# EAGLE design lora_32_v6 (EAGLE 9.5.2)

## Sheet 1 of 3
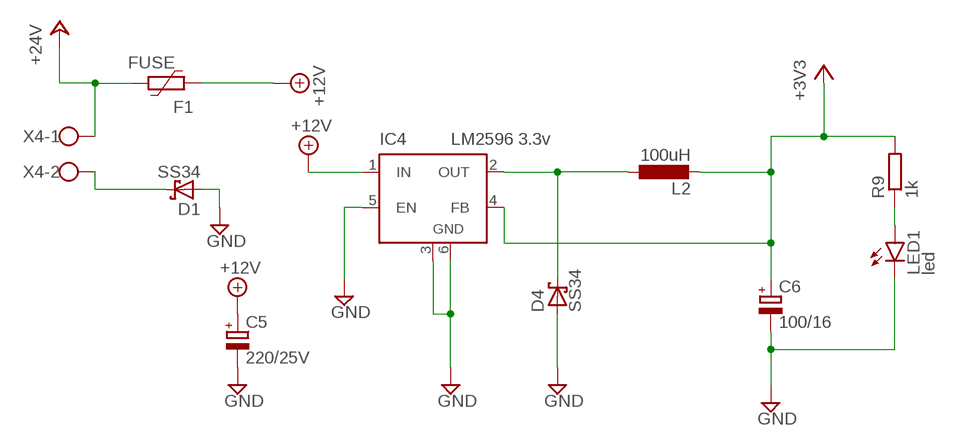
[diagram p0: schematic, sheet 1]

### Parts
C5  220/25V  CPOL-EUG  [PANASONIC_G]
C6  100/16  CPOL-EU140CLH-0810  [140CLH-0810]
D1  SS34  SCHOTTKY-DIODESMD  [SMB]
D4  SS34  SCHOTTKY-DIODESMD  [SMB]
F1  FUSE  1812L010  [1812L]
IC4  LM2596 3.3v  LM2596S  [TO263-5]
L2  100uH  L-EU6000-XXX-RC  [6000-XXXX-RC]
LED1  led  LEDSML0805  [SML0805]
R9  1k  R-EU_M0805  [M0805]
X4  W237-102  [W237-102]

### Nets
+3V3: C6.+ IC4.4(FB) L2.2 R9.2 ; also sheet 2,3
+12V: C5.+ F1.2 IC4.1(IN)
+24V: F1.1 X4.1 ; also sheet 2
GND: C5.- C6.- D1.A D4.A IC4.3(GND) IC4.5(EN) IC4.6(GND) LED1.C ; also sheet 2,3
N$4: D4.C IC4.2(OUT) L2.1
N$15: LED1.A R9.1
N$17: D1.C X4.2

## Sheet 2 of 3
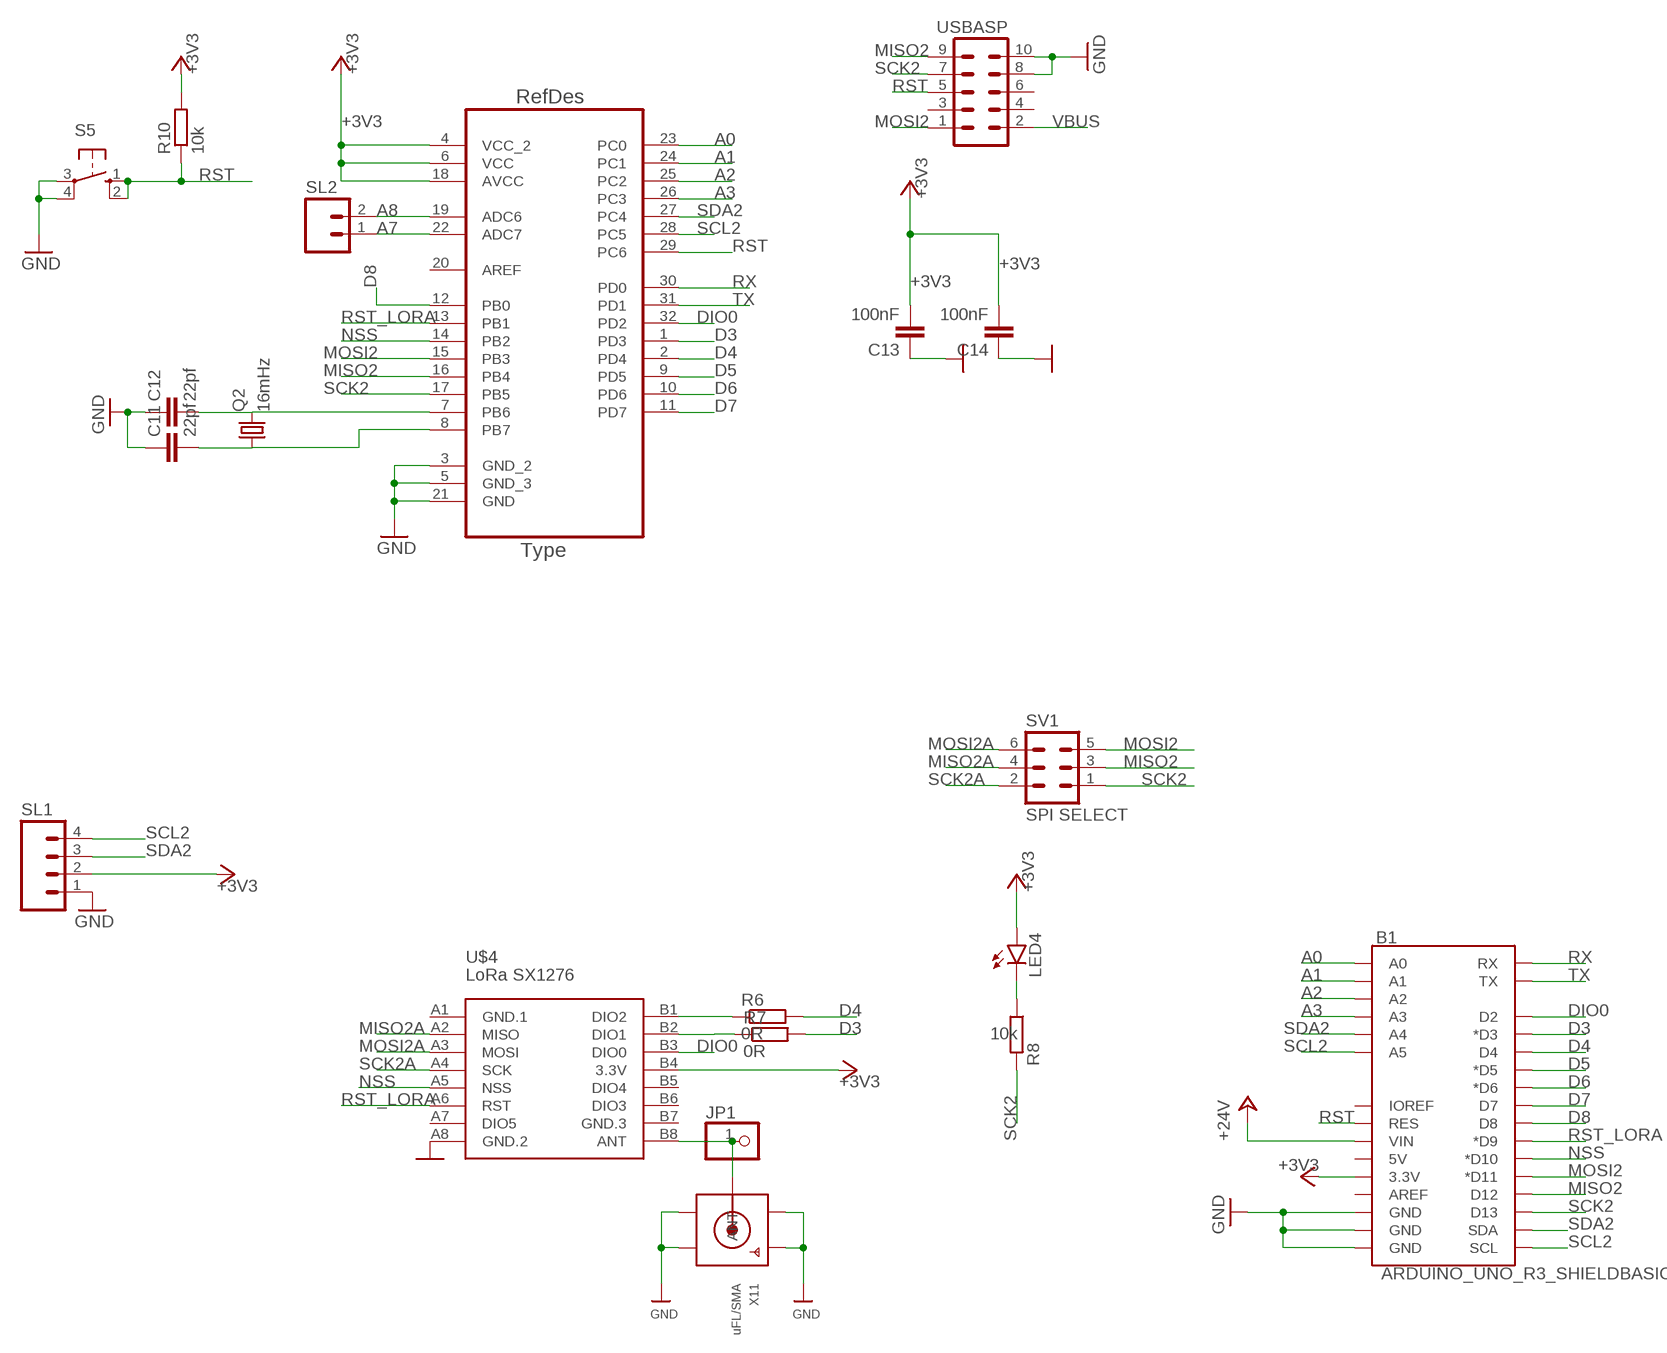
[diagram p1: schematic, sheet 2]

### Parts
B1  ARDUINO_UNO_R3_SHIELDBASIC  [UNO_R3_SHIELD]
C11  22pf  C-EUC0805K  [C0805K]
C12  22pf  C-EUC0805K  [C0805K]
C13  100nF  C-EUC0805K  [C0805K]
C14  100nF  C-EUC0805K  [C0805K]
JP1  HEADER-1X1ROUND  [1X01_ROUND]
LED4  LEDSML0805  [SML0805]
Q2  16mHz  CRYSTALHC49UP  [HC49UP]
R6  0R  R-EU_M0805  [M0805]
R7  0R  R-EU_M0805  [M0805]
R8  10k  R-EU_M0805  [M0805]
R10  10k  R-EU_M0805  [M0805]
S5  10-XX  [B3F-10XX]
SL1  M04  [04P]
SL2  M02  [02P]
SV1  SPI SELECT  MA03-2  [MA03-2]
U1  ATMEGA328P-AU  [QFP80P900X900X120-32N]
U$4  LoRa SX1276  WIRELESS-LORA-RFM95W#SMD  [WIRELESS-LORA-RFM95W#SMD]
USBASP  MA05-2  [MA05-2]
X11  uFL/SMA  SMACONNECTOR_EDGE_UFL  [SMA_EDGELAUNCH_UFL]

### Nets
+3V3: B1.3.3V C13.2 C14.2 LED4.A R10.2 SL1.2 U1.4(VCC_2) U1.6(VCC) U1.18(AVCC) U$4.B4(3.3V) ; also sheet 1,3
+24V: B1.VIN ; also sheet 1
A0: B1.A0 U1.23(PC0)
A1: B1.A1 U1.24(PC1)
A2: B1.A2 U1.25(PC2)
A3: B1.A3 U1.26(PC3)
A7: SL2.1 U1.22(ADC7)
A8: SL2.2 U1.19(ADC6)
D3: B1.D3(*D3) R7.2 U1.1(PD3)
D4: B1.D4 R6.2 U1.2(PD4)
D5: B1.D5(*D5) U1.9(PD5)
D6: B1.D6(*D6) U1.10(PD6)
D7: B1.D7 U1.11(PD7)
D8: B1.D8 U1.12(PB0)
DIO0: B1.D2 U1.32(PD2) U$4.B3(DIO0)
GND: B1.GND@0(GND) B1.GND@1(GND) B1.GND@2(GND) C11.1 C12.1 C13.1 C14.1 S5.3(P) S5.4(P1) SL1.1 U1.3(GND_2) U1.5(GND_3) U1.21(GND) U$4.A8(GND.2) USBASP.8 USBASP.10 X11.GND@1(GND1) X11.GND@2(GND2) X11.GND@3(GND3) X11.GND@4(GND4) ; also sheet 1,3
MISO2: B1.D12 SV1.3 U1.16(PB4) USBASP.9
MISO2A: SV1.4 U$4.A2(MISO)
MOSI2: B1.D11(*D11) SV1.5 U1.15(PB3) USBASP.1
MOSI2A: SV1.6 U$4.A3(MOSI)
N$3: C12.2 Q2.2 U1.7(PB6)
N$5: C11.2 Q2.1 U1.8(PB7)
N$20: R7.1 U$4.B2(DIO1)
N$21: R6.1 U$4.B1(DIO2)
N$22: LED4.C R8.1
N$37: JP1.1 U$4.B8(ANT) X11.P(ANT)
NSS: B1.D10(*D10) U1.14(PB2) U$4.A5(NSS)
RST: B1.RES R10.1 S5.1(S) S5.2(S1) U1.29(PC6) USBASP.5 ; also sheet 3
RST_LORA: B1.D9(*D9) U1.13(PB1) U$4.A6(RST)
RX: B1.RX U1.30(PD0) ; also sheet 3
SCK2: B1.D13 R8.2 SV1.1 U1.17(PB5) USBASP.7
SCK2A: SV1.2 U$4.A4(SCK)
SCL2: B1.A5 B1.SCL SL1.4 U1.28(PC5)
SDA2: B1.A4 B1.SDA SL1.3 U1.27(PC4)
TX: B1.TX U1.31(PD1) ; also sheet 3
VBUS: USBASP.2 ; also sheet 3
Unconnected: B1.5V B1.AREF B1.IOREF U1.20(AREF) U$4.A7(DIO5) U$4.B5(DIO4) U$4.B6(DIO3) USBASP.3 USBASP.4 USBASP.6

## Sheet 3 of 3
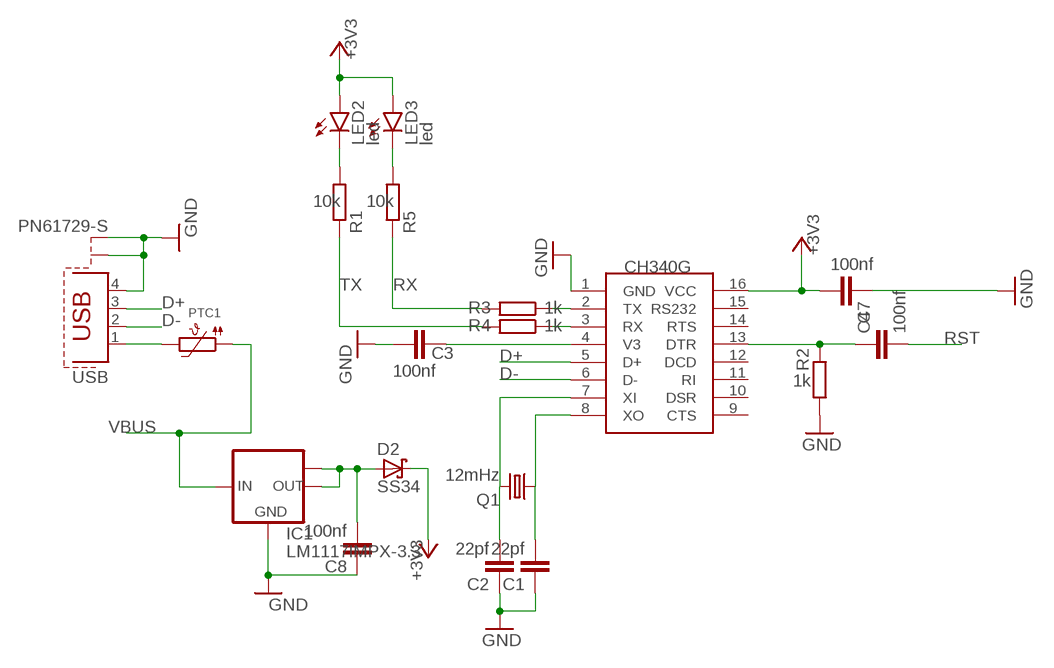
[diagram p2: schematic, sheet 3]

### Parts
C1  22pf  C-EUC0805K  [C0805K]
C2  22pf  C-EUC0805K  [C0805K]
C3  100nf  C-EUC0805K  [C0805K]
C4  100nf  C-EUC0805K  [C0805K]
C7  100nf  C-EUC0805K  [C0805K]
C8  100nf  C-EUC0805K  [C0805K]
D2  SS34  SCHOTTKY-DIODESMD  [SMB]
IC1  LM1117IMPX-3.3  [SOT223]
LED2  led  LEDSML0805  [SML0805]
LED3  led  LEDSML0805  [SML0805]
PTC1  PTC1206  [1206]
Q1  12mHz  CRYSTALHC49UP  [HC49UP]
R1  10k  R-EU_M0805  [M0805]
R2  1k  R-EU_M0805  [M0805]
R3  1k  R-EU_M0805  [M0805]
R4  1k  R-EU_M0805  [M0805]
R5  10k  R-EU_M0805  [M0805]
U$5  CH340G  [SOIC16]
USB  PN61729-S  [PN61729-S]

### Nets
+3V3: C7.2 D2.C LED2.A LED3.A U$5.16(VCC) ; also sheet 1,2
D+: U$5.5(D+) USB.3
D-: U$5.6(D-) USB.2
GND: C1.1 C2.1 C3.1 C7.1 C8.1 IC1.1(GND) R2.1 U$5.1(GND) USB.4 USB.S1 USB.S2 ; also sheet 1,2
N$7: C2.2 Q1.2 U$5.7(XI)
N$8: C1.2 Q1.1 U$5.8(XO)
N$9: C3.2 U$5.4(V3)
N$10: C4.1 R2.2 U$5.13(DTR)
N$11: R3.1 U$5.2(TX)
N$12: R4.1 U$5.3(RX)
N$13: PTC1.2 USB.1
N$14: C8.2 D2.A IC1.2(OUT) IC1.TAB(OUT1)
N$18: LED3.C R5.1
N$19: LED2.C R1.1
RST: C4.2 ; also sheet 2
RX: R3.2 R5.2 ; also sheet 2
TX: R1.2 R4.2 ; also sheet 2
VBUS: IC1.3(IN) PTC1.1 ; also sheet 2
Unconnected: U$5.9(CTS) U$5.10(DSR) U$5.11(RI) U$5.12(DCD) U$5.14(RTS) U$5.15(RS232)

## Power pins joined to a net without a drawn wire
GND.1: U$4.A1(GND.1)
GND.3: U$4.B7(GND.3)

## Library data of the parts
B1 = SparkFun-Boards:ARDUINO_UNO_R3_SHIELD: Arduino R3 Shield Footprint Shield form compatible with the Arduino Uno R3. SparkFun Products: MG2639 Cellular Shield <https://www.sparkfun.com/products/13120> MIDI Shield <https://www.sparkfun.com/products/12898> R3 Stackable Headers Kit <https://www.sparkfun.com/products/11417>
C1-C4 C7 C8 C11-C14 = rcl:C-EU: CAPACITOR, European symbol; SPICEPREFIX: C
C5 C6 = rcl:CPOL-EU: POLARIZED CAPACITOR, European symbol; SPICEPREFIX: C
D1 D2 D4 = diode:SCHOTTKY-DIODE: Schottky Diode
F1 = polyfuse-smd_10:?: Polyfuse Resettable PTC Source: http://www.littelfuse.com/products/resettable-ptcs.aspx; MF: Littelfuse; MPN: 1812L010; OC_FARNELL: 1822210; OC_NEWARK: 78R5551
IC1 = lm1117:LM1117IMPX-*
IC4 = linear:LM2596S: STEP-DOWN VOLTAGE REGULATOR
JP1 = microbuilder:HEADER-1X1: PIN HEADER
L2 = rcl:L-EU: INDUCTOR, European symbol; SPICEPREFIX: L
LED1-LED4 = led:LED: LED OSRAM: - CHIPLED LG R971, LG N971, LY N971, LG Q971, LY Q971, LO R971, LY R971 LH N974, LH R974 LS Q976, LO Q976, LY Q976 LO Q996 - Hyper CHIPLED LW Q18S LB Q993, LB Q99A, LB R99A - SideLED LS A670, LO A670, LY A670, LG A670, LP A670 LB A673, LV A673, LT A673, LW A673 LH A674 LY A675 LS A676, LA A676, LO A676, LY A676, LW A676 LS A679, LY A679, LG A679 - Hyper Micro SIDELED® LS Y876, LA Y876, LO Y876, LY Y876 LT Y87S - SmartLED LW L88C, LW L88S LB L89C, LB L89S, LG L890 LS L89K, LO L89K, LY L89K LS L896, LA L896, LO L896, LY L896 - TOPLED LS T670, LO T670, LY T670, LG T670, LP T670 LSG T670, LSP T670, LSY T670, LOP T670, LYG T670 LG T671, LOG T671, LSG T671 LB T673, LV T673, LT T673, LW T673 LH T674 LS T676, LA T676, LO T676, LY T676, LB T676, LH T676, LSB T676, LW T676 LB T67C, LV T67C, LT T67C, LS T67K, LO T67K, LY T67K, LW E67C LS E67B, LA E67B, LO E67B, LY E67B, LB E67C, LV E67C, LT E67C LW T67C LS T679, LY T679, LG T679 LS T770, LO T770, LY T770, LG T770, LP T770 LB T773, LV T773, LT T773, LW T773 LH T774 LS E675, LA E675, LY E675, LS T675 LS T776, LA T776, LO T776, LY T776, LB T776 LHGB T686 LT T68C, LB T68C - Hyper Mini TOPLED® LB M676 - Mini TOPLED Santana® LG M470 LS M47K, LO M47K, LY M47K Source: http://www.osram.convergy.de LUXEON: - LUMILED® LXK2-PW12-R00, LXK2-PW12-S00, LXK2-PW14-U00, LXK2-PW14-V00 LXK2-PM12-R00, LXK2-PM12-S00, LXK2-PM14-U00 LXK2-PE12-Q00, LXK2-PE12-R00, LXK2-PE12-S00, LXK2-PE14-T00, LXK2-PE14-U00 LXK2-PB12-K00, LXK2-PB12-L00, LXK2-PB12-M00, LXK2-PB14-N00, LXK2-PB14-P00, LXK2-PB14-Q00 LXK2-PR12-L00, LXK2-PR12-M00, LXK2-PR14-Q00, LXK2-PR14-R00 LXK2-PD12-Q00, LXK2-PD12-R00, LXK2-PD12-S00 LXK2-PH12-R00, LXK2-PH12-S00 LXK2-PL12-P00, LXK2-PL12-Q00, LXK2-PL12-R00 Source: www.luxeon.com KINGBRIGHT: KA-3528ASYC Source: www.kingbright.com
PTC1 = microbuilder:PTC: PTC (Resettable Fuse) 1206 Package 250mA PTC (16V Max, Time-to-Trip: 0.08s) - Digikey: F2110CT-ND 1210 Package 100mA PTC (30V Max, Time-to-Trip: 0.6s) - Digikey: MF-USMF010-2CT-ND 1812 Package 750mA PTC (24V Max, Time-to-Trip: 0.2s) - Digikey: MF-MSMF075/24-2CT-ND
Q1 Q2 = crystal:CRYSTAL: CRYSTAL; OC_FARNELL: unknown; OC_NEWARK: unknown
R1-R10 = rcl:R-EU_: RESISTOR, European symbol; SPICEPREFIX: R
S5 = switch-omron:10-XX: OMRON SWITCH; MPN: B3F-1000; OC_FARNELL: 176432; OC_NEWARK: 36M3542
SL1 = con-amp-quick:M04: AMP QUICK CONNECTOR; OC_FARNELL: unknown; OC_NEWARK: unknown
SL2 = con-amp-quick:M02: AMP QUICK CONNECTOR; OC_FARNELL: unknown; OC_NEWARK: unknown
SV1 = con-lstb:MA03-2: PIN HEADER; OC_FARNELL: unknown; OC_NEWARK: unknown
U1 = Atmel-ATMEGA328P-AU:ATMEGA328P-AU; DESCRIPTION: 8-bit Microcontroller with In-System Programmable Flash; MPN: ATMEGA328P-AU; OC_FARNELL: 1715486; OC_NEWARK: 14R4631; PACKAGE: TQFP-32; SUPPLIER: Atmel
U$4 = diy-modules:WIRELESS-LORA-RFM95W: 868/915 MHz LoRa Radio Transceiver Module based on SX1276 chip Click here to find device on ebay.com <http://www.ebay.com/sch/RFM95W+transceiver>
U$5 = ch340g:CH340G
USB = con-berg:PN61729-S: BERG USB connector; OC_FARNELL: unknown; OC_NEWARK: unknown
USBASP = con-lstb:MA05-2: PIN HEADER; OC_FARNELL: unknown; OC_NEWARK: unknown
X4 = con-wago-500-edit:W237-102: WAGO SCREW CLAMP; MPN: 237-102; OC_FARNELL: unknown; OC_NEWARK: 70K9898
X11 = microbuilder:SMACONNECTOR: SMA Connector 90° DIP SMA Connector, 50 Ohm (4UConnector: 07259)

## Net classes
0 default: width 0.152 mm, drill 0.152 mm, clearance 0.381 mm

## Board
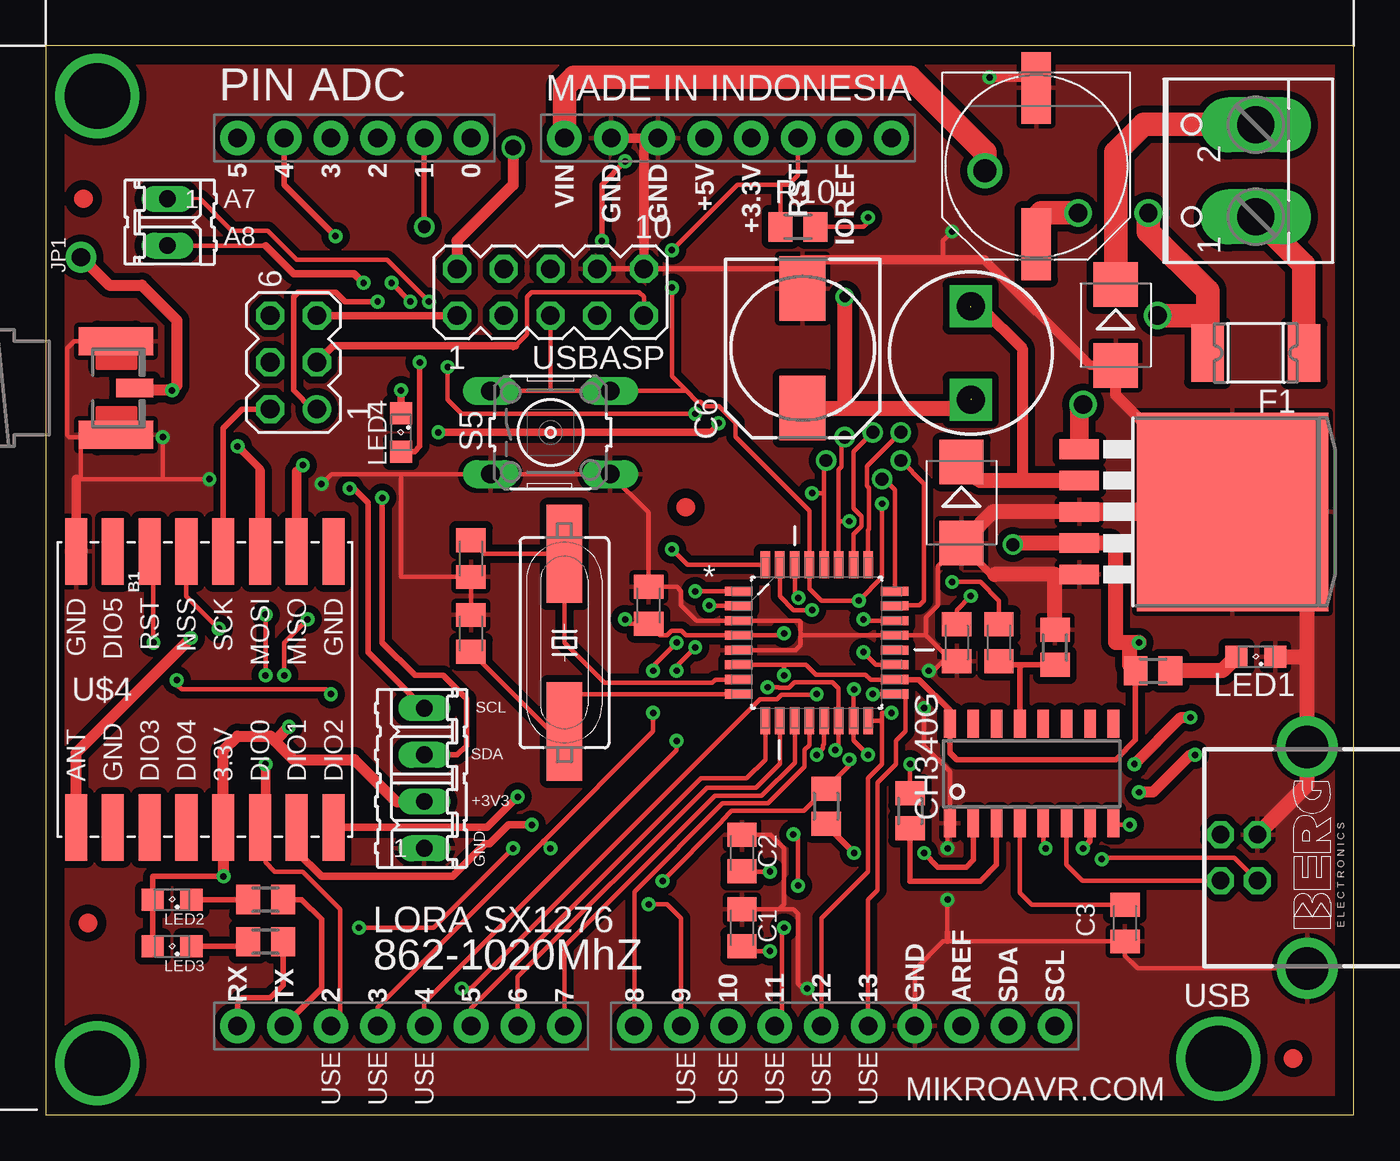
[diagram p3: board, top side]
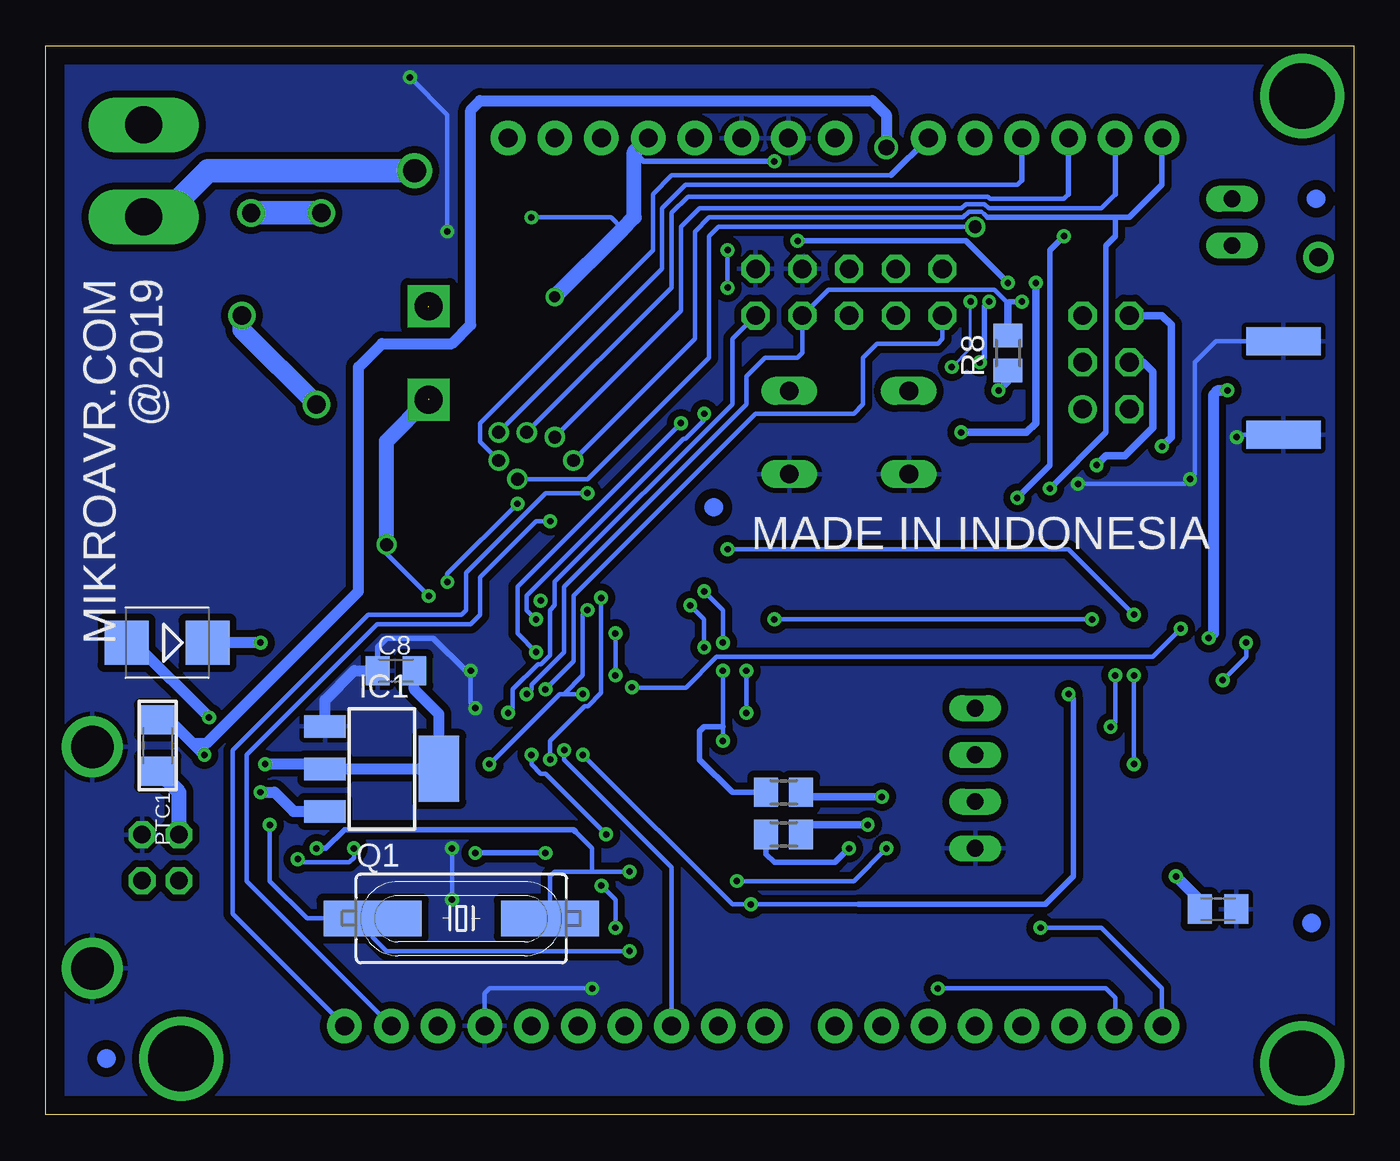
[diagram p4: board, bottom side, seen from below]

Size 71.1 x 58.09 mm. Coordinates in mm from the lower left corner, seen from the top.
Outline: 0,0 71.1,0 71.1,58.09 0,58.09 0,0
Copper layers (1*16): Top 0.035mm / dielectric 1.5mm / Bottom 0.035mm
Design rules "default": minimum track width 6mil, minimum drill 0.35mm, track to track 6mil, track to pad 6mil, pad to pad 6mil, via to via 6mil, smd to smd 6mil, copper to edge 40mil, drill to drill 6mil, minimum pad ring 10mil, minimum via ring 8mil, stop-mask expansion 4mil, vias tented up to drill 0mil, thermal gap 10mil

### Footprints (pad centres in the part's own frame; a part is rotated, then mirrored left to right if it is on the bottom)
UNO_R3_SHIELD = drill 1.016 pad 1.88: 3.3V 24.13,-2.54; 5V 24.13,0; A0 24.13,12.7; A1 24.13,15.24; A2 24.13,17.78; A3 24.13,20.32; A4 24.13,22.86; A5 24.13,25.4; AREF -24.13,-13.97; D2 -24.13,20.32; D3 -24.13,17.78; D4 -24.13,15.24; D5 -24.13,12.7; D6 -24.13,10.16; D7 -24.13,7.62; D8 -24.13,3.81; D9 -24.13,1.27; D10 -24.13,-1.27; D11 -24.13,-3.81; D12 -24.13,-6.35; D13 -24.13,-8.89; GND@0 24.13,2.54; GND@1 24.13,5.08; GND@2 -24.13,-11.43; IOREF 24.13,-7.62; NC 24.13,-10.16; RES 24.13,-5.08; RX -24.13,25.4; SCL -24.13,-19.05; SDA -24.13,-16.51; TX -24.13,22.86; VIN 24.13,7.62
C0805K = smd 1.3 x 1.6: 1 -1,0; 2 1,0
PANASONIC_G = smd 3.9 x 1.6: + 4.25,0; - -4.25,0
140CLH-0810 = smd 3.5 x 2.5: + 3.25,0; - -3.25,0
SMB = smd 2.4 x 2.4: A 2.2,0; C -2.2,0
1812L = smd 1.78 x 3.15: 1 -2.62,0; 2 2.62,0
SOT223 = smd 1.219 x 2.235: 1 -2.311,-3.099; 2 0,-3.099; 3 2.311,-3.099 | smd 3.6 x 2.2: TAB 0,3.099
TO263-5 = smd 1.067 x 2.159: 1 -3.404,-5.791; 2 -1.702,-5.791; 3 0,-5.791; 4 1.702,-5.791; 5 3.404,-5.791 | smd 10.8 x 10.41: 6 0,2.54
1X01_ROUND = drill 1 pad 1.676: 1 0,0
6000-XXXX-RC = drill 0.9 pad 1.422: 1 -2.5,0; 2 2.5,0
SML0805 = smd 1.2 x 1.2: A 1.05,0; C -1.05,0
1206 = smd 1.6 x 1.8: 1 -1.4,0; 2 1.4,0
HC49UP = smd 5.334 x 1.93: 1 -4.826,0; 2 4.826,0
M0805 = smd 1.3 x 1.6: 1 -0.95,0; 2 0.95,0
B3F-10XX = drill 1.016 long: 1 -3.251,2.261; 2 3.251,2.261; 3 -3.251,-2.261; 4 3.251,-2.261
04P = drill 0.914 long: 1 -3.81,0; 2 -1.27,0; 3 1.27,0; 4 3.81,0
02P = drill 0.914 long: 1 -1.27,0; 2 1.27,0
MA03-2 = drill 1.016: 1 -2.54,-1.27 | drill 1.016 octagon: 2 -2.54,1.27; 3 0,-1.27; 4 0,1.27; 5 2.54,-1.27; 6 2.54,1.27
QFP80P900X900X120-32N = smd 1.473 x 0.508: 1 -4.242,2.794; 2 -4.242,2.007; 3 -4.242,1.194; 4 -4.242,0.406; 5 -4.242,-0.406; 6 -4.242,-1.194; 7 -4.242,-2.007; 8 -4.242,-2.794; 17 4.242,-2.794; 18 4.242,-2.007; 19 4.242,-1.194; 20 4.242,-0.406; 21 4.242,0.406; 22 4.242,1.194; 23 4.242,2.007; 24 4.242,2.794 | smd 0.508 x 1.473: 9 -2.794,-4.242; 10 -2.007,-4.242; 11 -1.194,-4.242; 12 -0.406,-4.242; 13 0.406,-4.242; 14 1.194,-4.242; 15 2.007,-4.242; 16 2.794,-4.242; 25 2.794,4.242; 26 2.007,4.242; 27 1.194,4.242; 28 0.406,4.242; 29 -0.406,4.242; 30 -1.194,4.242; 31 -2.007,4.242; 32 -2.794,4.242
WIRELESS-LORA-RFM95W#SMD = smd 3.6 x 1.2: A1 -7.5,7; A2 -7.5,5; A3 -7.5,3; A4 -7.5,1; A5 -7.5,-1; A6 -7.5,-3; A7 -7.5,-5; A8 -7.5,-7; B1 7.5,7; B2 7.5,5; B3 7.5,3; B4 7.5,1; B5 7.5,-1; B6 7.5,-3; B7 7.5,-5; B8 7.5,-7
SOIC16 = smd 0.635 x 1.524: 1 -4.445,-2.695; 2 -3.175,-2.695; 3 -1.905,-2.695; 4 -0.635,-2.695; 5 0.635,-2.695; 6 1.905,-2.695; 7 3.175,-2.695; 8 4.445,-2.695; 9 4.445,2.695; 10 3.175,2.695; 11 1.905,2.695; 12 0.635,2.695; 13 -0.635,2.695; 14 -1.905,2.695; 15 -3.175,2.695; 16 -4.445,2.695
PN61729-S = drill 0.95 octagon: 1 1.25,4.71; 2 -1.25,4.71; 3 -1.25,2.71; 4 1.25,2.71 | drill 2.3 pad 2.9: S1 -6.02,0; S2 6.02,0
MA05-2 = drill 1.016 octagon: 1 -5.08,-1.27; 2 -5.08,1.27; 3 -2.54,-1.27; 4 -2.54,1.27; 5 0,-1.27; 6 0,1.27; 7 2.54,-1.27; 8 2.54,1.27; 9 5.08,-1.27; 10 5.08,1.27
W237-102 = drill 2 long: 1 -2.5,-1.27; 2 2.5,-1.27
SMA_EDGELAUNCH_UFL = smd 4.064 x 1.524: GND@1 2.032,-2.54; GND@2 2.032,2.54 | smd 4.064 x 1.524 bottom: GND@3 2.032,2.54; GND@4 2.032,-2.54 | smd 2.032 x 1.016: P 3.048,0

### Placement (x,y rotation side)
B1  35.81,28.96 90 top
C1  37.85,10.16 270 top
C2  37.85,14.22 270 top
C3  58.67,10.41 90 top
C4  51.82,25.65 90 top
C5  53.85,51.56 270 top
C6  41.15,41.66 270 top
C7  7.37,11.18 180 bottom
C8  52.07,24.13 0 bottom
C11  23.11,26.16 270 top
C12  23.11,30.23 90 top
C13  32.77,27.69 270 top
C14  49.53,25.65 90 top
D1  58.17,42.93 270 top
D2  64.52,25.65 180 bottom
D4  49.78,33.27 270 top
F1  65.79,41.4 180 top
IC1  52.83,18.8 270 bottom
IC4  61.98,32.77 270 top
JP1  1.9,46.61 0 top
L2  50.29,41.4 270 top
LED1  65.79,24.89 180 top
LED2  6.86,11.68 180 top
LED3  6.86,9.14 180 top
LED4  19.3,37.08 270 top
PTC1  65.02,20.07 270 bottom
Q1  48.51,10.67 0 bottom
Q2  28.19,25.65 90 top
R1  11.94,11.68 0 top
R2  54.86,25.4 270 top
R3  42.42,16.76 90 top
R4  46.99,16.51 90 top
R5  11.94,9.4 0 top
R6  30.99,17.53 180 bottom
R7  30.99,15.24 180 bottom
R8  18.8,41.4 90 bottom
R9  60.2,24.13 180 top
R10  40.89,48.26 0 top
S5  27.43,37.08 0 top
SL1  20.57,18.29 90 top
SL2  6.6,48.51 270 top
SV1  13.46,40.89 90 top
U1  41.91,25.65 0 top
U$3  [CIRCLE-1MM-2R]  2.03,49.78 0 top
U$4  8.64,23.11 270 top
U$5  53.59,18.54 0 top
U$6  [CIRCLE-1MM-2R]  2.29,10.41 0 top
U$7  [CIRCLE-1MM-2R]  34.8,33.02 0 top
U$8  [CIRCLE-1MM-2R]  67.82,3.05 0 top
USB  68.58,13.97 90 top
USBASP  27.43,44.7 0 top
X4  64.52,51.31 90 top
X11  1.78,39.5 0 top

### Tracks (layer width: path | path; a pad name or v marks a point on that pad's centre or on a via)
+3V3  (via drill 0.35, 0.6, 0.7, 1.52)  (1 unrouted)
  Top 0.254: U1.6 40.13,24.46 | 40.13,24.46 41.33,24.46 41.86,23.92 44.57,23.92 44.85,23.65 U1.18 | v40.13,26.16 40.03,26.06 U1.4 34.81,26.06 34.56,26.31 34.02,26.31 33.77,26.06 33.39,26.06 C13.2 31.73,26.69 v31.5,26.92 | v40.13,23.88 40.13,24.46 | v14.22,26.92 12.95,25.65 v12.95,23.88 | 9.91,15.88 U$4.B4 | C14.2 49.53,27.43 v50.29,28.19 | R10.2 44.45,48.26 44.7,48.51 v44.7,48.77
  Top 0.305: U1.18 47.47,23.65 49.15,21.97 U$5.16 49.15,19.68 49.53,19.3 58.17,19.3 59.25,20.39 R9.2 | LED3.A LED2.A 5.81,12.92 5.84,12.95 v9.65,12.95 | LED4.A 20.03,36.03 20.32,36.32 v20.32,40.89 | v19.81,44.2 v18.8,45.21 | v30.23,47.5 30.23,50.55 v31.5,51.82
  Top 0.61: SL1.2 19.05,17.02 16.76,19.3 13.46,19.3 12.57,20.19 | 12.57,20.19 12.19,20.57 10.41,20.57 9.64,19.8 U$4.B4 9.65,15.6 v9.65,12.95 | v13.21,21.08 12.57,20.45 12.57,20.19
  Top 0.813: C6.+ 43.43,38.41 | 43.43,38.41 49.8,38.41 L2.2 | v52.58,30.99 52.65,31.06 IC4.4 57.84,31.06 58.17,30.73 58.17,25.65 58.93,25.65 | 43.43,38.41 v43.43,44.45 | v59.44,25.65 58.93,25.65 | R9.2 58.93,24.45 58.93,25.65
  Bottom 0.254: v40.13,26.16 v40.13,23.88 | v31.5,26.92 v14.22,26.92 | v12.95,23.88 12.95,21.34 v13.21,21.08 | v50.29,28.19 52.58,30.48 v52.58,30.99 | 8.64,11.94 8.37,11.67 C7.2 | v44.7,48.77 40.39,48.77 39.75,48.13
  Bottom 0.305: v20.32,40.89 20.07,41.15 20.07,43.94 v19.81,44.2 | v18.8,45.21 21.08,47.5 v30.23,47.5 | 39.12,52.32 38.61,51.82 v31.5,51.82
  Bottom 0.61: 8.38,11.68 8.64,11.94 v9.65,12.95 | v59.44,25.65 D2.C
  Bottom 0.813: v52.58,30.99 52.58,36.62 L2.2 | v43.43,44.45 39.75,48.13 39.12,48.77 39.12,52.32 B1.3.3V
  other vias: 50.29,38.86
+12V  (via drill 1)
  Top 1.016: IC4.1 56.19,38.4 v56.39,38.61
  Top 1.27: v59.94,49.02 59.94,48.01 63.17,44.78 63.17,43.43 | v56.13,49.02 54.14,49.02 53.85,48.73 C5.+ | F1.2 63.17,43.43 | v60.45,43.43 63.17,43.43
  Bottom 1.016: v56.39,38.61 60.45,42.67 v60.45,43.43
  Bottom 1.27: v59.94,49.02 v56.13,49.02
+24V  (via drill 1.27)
  Top 1.27: B1.VIN 28.19,55.88 28.7,56.39 46.99,56.39 51.05,52.32 v51.05,51.31 | F1.1 68.41,46.19 X4.1
  Bottom 1.27: v51.05,51.31 62.27,51.31 64.77,48.81 X4.1
A0  (via drill 0.7)
  Top 0.254: U1.23 46.18,27.69 47.5,27.69 47.75,27.94 47.75,34.29 v46.48,35.56
  Bottom 0.254: v46.48,35.56 47.5,36.58 47.5,37.59 38.1,46.99 38.1,50.04 37.08,51.05 25.15,51.05
  Bottom 0.305: 25.15,51.05 B1.A0
A1  (via drill 0.7)
  Top 0.254: U1.24 46.15,33.96 45.57,34.54 v45.47,34.54
  Top 0.305: v20.57,48.26 B1.A1
  Bottom 0.254: v45.47,34.54 41.66,34.54 35.05,41.15 35.05,47.75 34.54,48.26 v20.57,48.26
A2  (via drill 0.7)
  Top 0.254: v46.48,37.08 44.63,35.23 44.63,34.2 44.75,34.08 44.75,31.82 44.7,31.77 U1.25
  Bottom 0.254: v46.48,37.08 37.59,45.97 37.59,49.28 36.32,50.55 18.29,50.55 18.03,50.8
  Bottom 0.305: 18.03,50.8 B1.A2
A3  (via drill 0.7)
  Top 0.254: v44.96,37.08 43.92,36.04 43.92,32.96 44.35,32.53 44.35,31.99 43.92,31.56 U1.26
  Bottom 0.254: v44.96,37.08 37.08,44.96 37.08,49.02 36.2,49.9 19.89,49.9 19.77,49.78 15.75,49.78 15.49,50.04
  Bottom 0.305: 15.49,50.04 B1.A3
A7  (via drill 0.35)
  Top 0.152: 8.38,49.78 SL2.1
  Top 0.254: U1.22 44.53,26.85 v44.45,26.92 | v35.31,38.1 22.61,38.1 21.84,38.86 v21.84,40.64 | v20.83,44.2 18.54,46.48 13.64,46.48 12.06,48.06 10.11,48.06 8.38,49.78
  Bottom 0.152: v21.84,40.64 20.83,41.66 v20.83,44.2 | 36.42,36.73 36.32,36.73 | 35.31,37.75 v35.31,38.1
  Bottom 0.254: v44.45,26.92 44.96,27.43 44.96,28.19 36.42,36.73 | 36.32,36.73 35.31,37.75
A8  (via drill 0.35)
  Top 0.254: U1.19 45.14,24.46 v44.45,25.15 | v36.58,37.59 36.07,37.08 | 11.94,47.24 SL2.2
  Top 0.406: v17.27,45.21 16.76,45.72 13.46,45.72 11.94,47.24 | 36.07,37.08 v21.34,37.08
  Bottom 0.254: v44.45,25.15 45.47,26.16 45.47,28.7 v36.58,37.59
  Bottom 0.406: v17.27,45.21 17.27,37.59 17.78,37.08 v21.34,37.08
D3  (via drill 0.35)
  Top 0.254: B1.D3 18.03,5.84 27.05,14.86 33.02,20.83 v33.02,21.84 | v33.02,24.13 33.02,24.38 v34.29,25.65 | v35.31,28.45 U1.1
  Top 0.305: v27.43,14.48 27.05,14.86
  Bottom 0.254: v33.02,21.84 v33.02,24.13 | v34.29,25.65 34.29,27.43 v35.31,28.45
  Bottom 0.305: R7.2 31.94,14.16 31.5,13.72 28.19,13.72 v27.43,14.48
D4  (via drill 0.35)
  Top 0.254: B1.D4 20.57,6.1 34.29,19.81 v34.29,20.32 | U1.2 36.09,27.66 v36.07,27.69 | v35.31,25.4 34.29,24.38 v34.29,24.13
  Bottom 0.254: v36.07,27.69 35.31,26.92 v35.31,25.4 | v34.29,24.13 34.29,21.08 v34.29,20.32
  Bottom 0.305: R6.2 33.78,17.53 35.56,19.3 35.56,20.83 35.31,21.08 34.29,21.08
D5
  Top 0.254: U1.9 39.12,19.3 38.1,18.29 35.63,18.29 23.11,5.78 B1.D5
D6
  Top 0.254: U1.10 39.9,19.07 38.61,17.78 35.95,17.78 25.65,7.49 B1.D6
D7
  Top 0.254: U1.11 40.72,19.13 38.91,17.32 36.37,17.32 28.19,9.14 B1.D7
D8
  Top 0.254: B1.D8 32,12.12 36.8,16.92 39.27,16.92 41.25,18.9 41.25,19.83 41.5,20.08 U1.12
D+  (via drill 0.35)
  Top 0.254: USB.3 64.62,13.97 57.49,13.97 v57.4,13.89 | v54.36,14.48 54.23,14.61 U$5.5
  Bottom 0.254: v57.4,13.89 57.23,13.72 54.61,13.72 54.36,13.97 v54.36,14.48
D-
  Top 0.254: USB.2 56.37,12.72 55.5,13.59 U$5.6
DIO0  (via drill 0.35)
  Top 0.254: U1.32 34.87,29.9 v34.04,30.73 | v11.94,27.18 v11.94,23.88 | U$4.B3 11.94,15.92 11.94,14.48 11.94,13.97 11.94,13.72 12.45,13.21 13.97,13.21 16,11.18 16,5.33 B1.D2
  Top 0.508: v11.94,19.05 11.94,15.92
  Bottom 0.254: v11.94,27.18 15.49,30.73 v34.04,30.73 | v11.94,23.88 v11.94,19.05
GND  (via drill 0.35)
  Top 0.254: USB.S1 59.36,7.95 58.67,8.64 C3.1 49.02,9.41 48.77,9.41 47.24,7.89 B1.GND@2 | v49.02,14.48 49.02,15.72 U$5.1 49.15,18.67 47.75,20.07 v47.75,22.1 | v49.02,11.68 49.02,9.91 49.02,9.67 | 47.85,26.06 U1.21 41.12,26.06 41.02,26.16 | 47.85,26.06 49.26,24.65 C14.1 48.77,24.65 48.24,24.13 v48.01,24.13 | U1.5 40.74,25.25 41.02,25.53 41.02,26.16 | 41.02,26.16 41.02,26.8 40.97,26.85 U1.3 35.38,26.85 34.54,27.69 34.54,28.45 34.31,28.69 C13.1 32.77,32.74 S5.4 S5.3 19.3,34.82 | C2.1 39.39,15.22 40.13,14.48 40.13,11.43 39.86,11.16 | C11.1 C12.1 19.3,29.23 19.3,34.82 | 19.3,34.82 15.52,34.82 v14.99,34.29 | v8.89,34.54 6.35,34.54 | 6.35,34.54 1.89,34.54 | 1.89,34.54 1.64,34.54 | 47.85,26.06 47.85,27.03 48.51,27.69 48.51,29.8 50.12,31.41 | v49.28,48.01 48.77,47.5 48.77,46.48 | C1.1 39.86,11.16 | 39.86,11.16 40.62,11.16 40.64,11.18 40.89,10.92 40.89,7.11 41.15,6.86 v41.4,6.86 | v6.35,36.83 6.35,34.54 | X11.GND@3 1.52,42.04 1.14,41.66 1.14,36.96 1.27,36.83 2.03,36.83 | 2.03,36.83 3.68,36.83 X11.GND@4 | 2.03,36.83 1.89,36.69 1.89,34.54
  Top 0.305: IC4.6 64.77,32.77 65.66,31.88 68.33,29.21 | 55.37,29.46 56.08,29.46 IC4.5 | USBASP.8 USBASP.10 40.64,45.97 40.64,45.72 | 41.15,46.48 41.15,46.23 C6.- | 49.02,9.91 49.02,9.41
  Top 0.406: IC4.5 54.86,29.36 | D4.A 49.78,30.99 51.33,29.44 51.51,29.44 51.58,29.36
  Top 0.508: U$4.A8 1.64,34.54 | 41.15,46.23 40.64,45.72 | 58.17,40.89 D1.A 56.79,40.73 51.03,46.48 48.77,46.48 41.15,46.48 | B1.GND@0 32.51,53.09 | 32.51,53.09 B1.GND@1 | USBASP.10 32.51,53.09 | v51.31,56.39 53.59,56.39 53.85,56.13 C5.-
  Top 0.61: 50.12,31.41 D4.A | IC4.6 58.17,39.12 D1.A
  Top 0.813: R2.1 54.86,29.36 51.58,29.36 | IC4.3 51.48,32.77 50.12,31.41 | USB.4 68.58,17.93 USB.S2 68.58,24.64 | 68.58,24.64 68.58,28.96 65.66,31.88 | LED1.C 68.33,24.89 68.58,24.64
  Top 1.016: IC4.3 IC4.6
  Bottom 0.254: v49.02,11.68 v49.02,14.48 | v14.99,34.29 9.14,34.29 v8.89,34.54 8.64,34.8 8.64,40.89 7.49,42.04 X11.GND@3 | v51.31,56.39 49.28,54.36 v49.28,48.01 | v47.75,22.1 48.01,22.35 v48.01,24.13 | B1.GND@2 47.24,6.6 46.99,6.86 v41.4,6.86 | X11.GND@4 6.22,36.96 v6.35,36.83
  Bottom 0.305: C8.1 53.07,25.42 52.58,25.91 50.04,25.91 48.26,24.13 v48.01,24.13
  Bottom 0.61: IC1.1 55.93,22.54 54.34,24.13 C8.1
  pour Top: 0,58.17 71.12,58.17 71.12,0.25 70.87,0 0,0
  pour Bottom: 0,58.17 71.12,58.17 71.12,0.25 70.87,0 0,0
MISO2  (via drill 0.35)
  Top 0.254: 25.4,41.66 25.53,41.78 26.16,42.42 26.16,44.45 26.42,44.7 32.26,44.7 32.51,44.45 USBASP.9 | v45.97,21.84 45.47,21.84 45.47,21.34 | B1.D12 42.16,10.67 44.7,13.21 44.7,18.29 45.47,19.05 45.47,21.34 | U1.16 45.39,21.41 45.47,21.34
  Top 0.406: 25.53,41.78 15.62,41.78 SV1.3
  Bottom 0.254: v45.97,21.84 45.72,22.1 45.72,23.11 44.35,24.49 44.18,24.49 43.69,24.98 43.69,27.43 43.43,27.69 43.43,28.96 33.78,38.61 33.78,42.16 USBASP.9
MISO2A  (via drill 0.35)
  Top 0.254: 13.64,34.97 v13.97,35.31
  Top 0.508: U$4.A2 13.64,34.97
  Bottom 0.406: v13.97,35.31 13.46,35.81 12.45,35.81 10.92,37.34 10.92,40.39 11.43,40.89 SV1.4
MOSI2  (via drill 0.35)
  Top 0.254: v43.94,23.11 43.92,23.09 U1.15 43.92,20.34 v44.7,19.56 | B1.D11 40.03,5.23 40.03,9.8 40.13,9.91 v40.13,10.16 | v40.89,12.45 40.89,14.99 v40.64,15.24
  Top 0.406: USBASP.1 18.54,43.43 SV1.5
  Bottom 0.254: v43.94,23.11 42.42,24.64 42.42,28.19 32.51,38.1 27.18,38.1 26.67,38.61 26.67,41.15 25.91,41.91 22.61,41.91 22.35,42.16 USBASP.1 | v40.13,10.16 40.13,11.68 v40.89,12.45 | v40.64,15.24 43.94,18.54 44.2,18.54 44.7,19.05 v44.7,19.56
MOSI2A  (via drill 0.35)
  Top 0.406: 11.64,35 11.64,35.1 v10.41,36.32
  Top 0.508: U$4.A3 11.64,35
  Bottom 0.406: v10.41,36.32 9.91,36.83 9.91,42.93 10.41,43.43 SV1.6
N$1  (via drill 3.56)
  other vias: 2.79,2.79
N$2  (via drill 3.56)
  other vias: 2.79,55.37
N$3
  Top 0.254: C12.2 23.86,30.48 Q2.2 28.19,25.65 30.38,23.47 36.22,23.47 36.4,23.65 U1.7
N$4  (via drill 1.52)  (1 unrouted)
  Top 0.61: L2.1 50.84,43.9 53.09,41.66 53.09,34.47
  Top 0.813: IC4.2 53.09,34.47 50.79,34.47 D4.C
  other vias: 50.29,43.94
N$5
  Top 0.254: C11.2 27.45,20.83 Q2.1 28.19,22.61 28.45,22.86 U1.8
N$6  (via drill 3.56)
  other vias: 63.75,3.05
N$7  (via drill 0.35)
  Top 0.254: v39.37,13.21 37.86,13.21 C2.2
  Top 0.305: U$5.7 56.77,14.86 v56.39,14.48
  Bottom 0.254: Q1.2 43.69,12.95 43.43,13.21 41.4,13.21 | 41.4,13.21 v39.37,13.21 | 42.29,15.37 41.4,14.48 41.4,13.21
  Bottom 0.305: v56.39,14.48 55.88,14.48 54.86,15.49 42.42,15.49 42.29,15.37
N$8  (via drill 0.35)
  Top 0.254: v58.93,15.75 58.14,15.75 U$5.8 | C1.2 38.12,8.89 v39.37,8.89
  Bottom 0.254: v58.93,15.75 58.93,12.7 56.9,10.67 Q1.1 53.34,9.65 52.58,8.89 v39.37,8.89
N$9
  Top 0.254: C3.2 53.61,11.41 52.96,12.07 U$5.4
N$10
  Top 0.305: R2.2 53.09,24.45 | 53.09,24.45 52.02,24.45 C4.1 | U$5.13 52.96,24.32 53.09,24.45
N$11  (via drill 0.35)
  Top 0.305: U$5.2 50.42,13.84 50.04,13.46 48.51,13.46 v47.75,14.22 | v43.94,14.22 42.42,15.75 R3.1
  Bottom 0.305: v47.75,14.22 v43.94,14.22
N$12
  Top 0.305: U$5.3 51.69,13.59 50.8,12.7 46.99,12.7 R4.1
N$13
  Bottom 0.813: USB.1 63.87,17.51 PTC1.2
N$14  (via drill 0.35)
  Top 0.61: v59.18,19.05 61.72,21.59 v62.23,21.59
  Bottom 0.61: C8.2 51.07,23.11 49.73,21.78 IC1.TAB IC1.2 56.19,19.05 v59.18,19.05 | v62.23,21.59 66.29,25.65 D2.A
N$15
  Top 0.813: LED1.A 63.97,24.13 R9.1
N$17
  Top 1.27: D1.C 58.17,52.32 59.69,53.85 65.75,53.85 X4.2
N$18
  Top 0.305: R5.1 10.73,9.14 LED3.C
N$19
  Top 0.305: R1.1 LED2.C
N$20  (via drill 0.35)
  Top 0.406: U$4.B2 13.64,14.3 14.99,12.95 22.1,12.95 23.88,14.73 24.13,14.73 25.15,15.75 v26.42,15.75
  Bottom 0.406: v26.42,15.75 29.53,15.75 R7.1
N$21  (via drill 0.35)
  Top 0.406: U$4.B1 24,15.61 v25.65,17.27
  Bottom 0.406: v25.65,17.27 29.78,17.27 R6.1
N$22  (via drill 0.35)
  Top 0.406: LED4.C v19.3,39.37
  Bottom 0.406: v19.3,39.37 18.8,39.88 R8.1
N$37  (via drill 0.35)
  Top 0.254: 4.95,39.37 X11.P
  Top 0.61: U$4.B8 1.64,19.67 v7.87,25.91 | 4.95,39.37 v6.86,39.37 7.11,39.62 7.11,43.18 5.21,45.08 3.43,45.08 JP1.1
  Bottom 0.61: v7.87,25.91 7.62,26.16 7.62,39.12 7.37,39.37 v6.86,39.37
NSS  (via drill 0.35)
  Top 0.254: v39.23,23.23 39.84,23.23 39.86,23.22 40.4,23.22 40.7,23.52 42.78,23.52 43.1,23.19 U1.14 43.1,20 v42.92,19.82 | v9.4,26.42 7.64,28.18 U$4.A5
  Bottom 0.254: v9.4,26.42 10.92,24.89 34.63,24.89 36.3,23.22 39.22,23.22 v39.23,23.23 | v42.92,19.82 42.92,19.3 37.08,13.46 B1.D10
RST  (via drill 0.35)
  Top 0.254: 27.43,39.34 S5.2 34.82,39.34 | 27.43,39.34 S5.1 | USBASP.5 27.43,39.34 | C4.2 51.82,27.94 50.8,28.96 v49.28,28.96 | 34.82,39.34 34.04,40.13 v34.04,44.96 | v34.04,46.99 37.59,50.55 39.88,50.55 | 39.88,50.55 40.39,50.55 40.89,51.05 B1.RES | v45.47,33.21 45.47,29.21 v44.2,27.94 42.16,27.94 41.5,28.6 U1.29 41.5,32.83 37.49,36.85 37.49,37.61 36.59,38.5 35.83,38.5 35.58,38.76 35.41,38.76 34.82,39.34 | R10.1 39.94,50.48 39.88,50.55
  Bottom 0.254: v34.04,44.96 v34.04,46.99 | v49.28,28.96 49.28,29.4 v45.47,33.21
RST_LORA  (via drill 0.35)
  Top 0.254: v7.11,23.62 7.11,23.37 7.37,23.11 15.24,23.11 v15.49,22.86 | v5.84,25.65 5.84,30.41 U$4.A6 | B1.D9 34.54,10.67 33.78,11.43 v32.77,11.43 | U1.13 42.32,20.15 42.26,20.09 42.26,19.91 v41.91,19.56
  Bottom 0.254: v7.11,23.62 5.84,24.89 v5.84,25.65 | 26.92,11.43 v32.77,11.43 33.78,11.43 v41.91,19.56
  Bottom 0.305: 26.92,11.43 16.76,11.43 15.24,12.95 15.24,22.61 v15.49,22.86
RX  (via drill 0.35)
  Top 0.254: v43.69,19.3 43.69,18.98 R3.2 41.21,16.51 37.29,16.51 36.77,15.99 36.77,15.94 v33.53,12.7 | v40.91,28.09 40.72,28.29 U1.30 | v25.4,14.48 21.08,10.16 v17.02,10.16
  Top 0.305: R5.2 12.89,7.05 12.19,6.35 10.67,6.35 10.41,6.1 B1.RX
  Bottom 0.254: v43.69,19.3 43.69,20.32 41.81,22.2 41.64,22.2 40.91,22.93 v40.91,28.09 | v33.53,12.7 27.18,12.7 v25.4,14.48 | v17.02,10.16 13.72,10.16 10.41,6.86 B1.RX
SCK2  (via drill 0.35)
  Top 0.254: v44.96,22.86 U1.17 46.74,22.86 46.74,20.83 46.23,20.32 46.23,19.05 45.21,18.04 45.21,12.19 44.7,11.68 B1.D13
  Top 0.305: SV1.1 14.48,38.35 13.46,39.37 13.46,44.45 13.72,44.7 15.75,44.7 16.26,44.2 v18.03,44.2
  Bottom 0.254: v44.96,22.86 44.7,23.11 44.7,23.37 42.93,25.15 42.93,28.7 33.02,38.61 33.02,40.13 32,41.15 30.23,41.15 29.97,41.4 USBASP.7 28.55,44.85 19.54,44.85 18.8,44.11
  Bottom 0.305: v18.03,44.2 18.71,44.2 18.8,44.11
  Bottom 0.406: R8.2 18.8,44.11
SCK2A
  Top 0.305: U$4.A4 9.64,37.32 10.67,38.35 SV1.2
SCL2  (via drill 0.35, 0.7)
  Top 0.254: U1.28 42.32,33.78 | 42.32,33.78 42.32,35.46 v42.42,35.56 | v41.66,33.78 42.32,33.78
  Top 0.305: SL1.4 17.53,25.15 17.53,33.27 16.76,34.04 v16.51,34.04
  Bottom 0.254: v42.42,35.56 35.81,42.16 35.81,48.01 35.05,48.77 21.24,48.77 20.92,49.09 20.23,49.09 20.11,48.98 19.91,48.77 | B1.SCL 60.96,10.92 60.96,19.81 53.59,27.18 48.51,27.18 48.26,27.43 48.26,29.46 43.94,33.78 v41.66,33.78
  Bottom 0.305: B1.A5 10.41,50.55 12.19,48.77 12.95,48.77 | 19.91,48.77 12.95,48.77 | v16.51,34.04 13.46,37.08 13.46,47.24 12.95,47.75 12.95,48.77
SDA2  (via drill 0.35, 0.7)
  Top 0.254: U1.27 43.1,32.26 | 43.1,32.26 43.1,35.07 43.25,35.21 43.25,36.65 v43.43,36.83 | v43.69,32.26 43.1,32.26
  Top 0.305: SL1.3 22.35,19.56 22.86,20.07 22.86,22.61 21.59,23.88 20.07,23.88 18.29,25.65 v18.29,33.53 | v15.75,47.75 12.95,50.55 B1.A4
  Bottom 0.254: v43.43,36.83 36.58,43.69 36.58,48.26 35.56,49.28 21.31,49.28 21.09,49.5 20.06,49.5 19.84,49.28 13.72,49.28 12.95,50.04 | B1.SDA 60.2,12.7 60.2,19.56 53.09,26.67 48.01,26.67 47.5,27.18 47.5,29.21 44.45,32.26 v43.69,32.26
  Bottom 0.305: 12.95,50.04 B1.A4 | v18.29,33.53 16.51,35.31 16.51,46.99 v15.75,47.75
TX  (via drill 0.35)
  Top 0.254: v46.99,19.05 R4.2 | v41.66,27.43 40.64,27.43 39.9,28.17 U1.31 | v41.91,22.86 41.86,22.81 40,22.81 39.76,22.58 38.83,22.58 23.11,6.86 v22.61,6.86
  Top 0.305: B1.TX 14.99,6.86 14.99,10.61 13.91,11.68 R1.2
  Bottom 0.254: 42.93,22.86 41.91,23.88 41.91,27.18 v41.66,27.43 | v46.99,19.05 43.18,22.86 42.93,22.86 | 42.93,22.86 v41.91,22.86 | v22.61,6.86 13.46,6.86 12.95,6.35 B1.TX
VBUS  (via drill 0.35, 0.85)
  Top 0.61: v62.48,19.56 62.23,19.56 60.2,17.53 v59.44,17.53 | v25.4,52.58 25.4,50.55 22.35,47.5 USBASP.2
  Bottom 0.61: PTC1.1 64.39,21.47 63.12,20.19 | v62.48,19.56 63.12,20.19 | v59.44,17.53 58.67,17.53 57.63,16.48 IC1.3 | 63.12,20.19 62.36,20.19 54.1,28.45 54.1,40.64 52.83,41.91 49.02,41.91 48.01,42.93 48.01,54.61 47.5,55.12 26.16,55.12 25.4,54.36 v25.4,52.58

### Text on the board
tPlace: PIN ADC | MADE IN INDONESIA | A7 | A8 | SCL | SDA | +3V3 | GND | LORA SX1276 | 862-1020MhZ | USE | USE | USE | USE | USE | USE | USE | USE | MIKROAVR.COM
bPlace: @2019 | MIKROAVR.COM | MADE IN INDONESIA
tValues: usbasp | ant | rst | ch340G